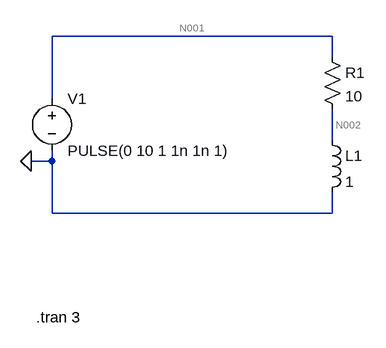
[diagram p0: schematic LR Circuit.asc]
LR Circuit.asc, the LTspice schematic file:
Version 4
SHEET 1 880 680
WIRE 48 -144 -384 -144
WIRE 48 -112 48 -144
WIRE -384 -48 -384 -144
WIRE 48 16 48 -32
WIRE -384 48 -384 32
WIRE -384 48 -416 48
WIRE -384 128 -384 48
WIRE 48 128 48 96
WIRE 48 128 -384 128
FLAG -416 48 0
SYMBOL voltage -384 -64 R0
WINDOW 123 0 0 Left 2
WINDOW 39 0 0 Left 2
SYMATTR InstName V1
SYMATTR Value PULSE(0 10 1 1n 1n 1)
SYMBOL res 32 -128 R0
SYMATTR InstName R1
SYMATTR Value 10
SYMBOL ind 32 0 R0
SYMATTR InstName L1
SYMATTR Value 1
SYMATTR SpiceLine Rser=0 Rpar=0
TEXT -408 288 Left 2 !.tran 3

The netlist it stands for:
* LR Circuit.asc
V1 N001 0 PULSE(0 10 1 1n 1n 1)
R1 N001 N002 10
L1 N002 0 1 Rser=0 Rpar=0
.tran 3
.backanno
.end

* Results of the author's LTspice run, read from the files saved beside the schematic
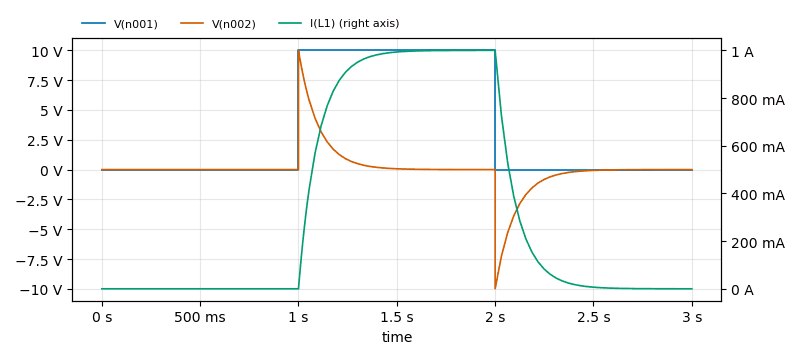
[diagram p1: Transient Analysis of LR Circuit.asc, plotted from the saved traces]
* Transient Analysis, 1 run:
*   V(n001): min 0 V, max 10 V, average 3.333 V, rms 5.774 V, last 0 V
*   V(n002): min -10 V, max 10 V, average -1.092 mV, rms 1.846 V, last -453.7 µV
*   I(L1): min 0 A, max 1 A, average 333.4 mA, rms 548.1 mA, last 45.37 µA